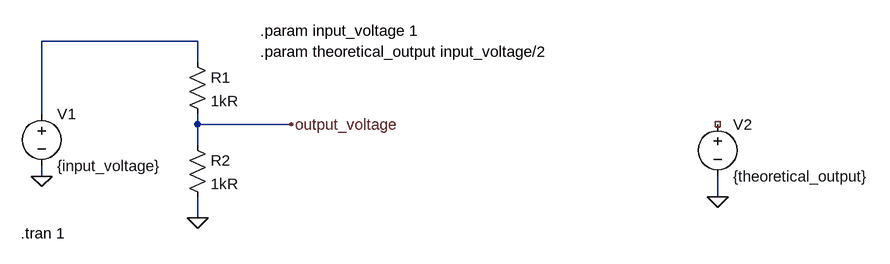
[diagram p0: schematic Draft9 param and step directives.asc]
Draft9 param and step directives.asc, the LTspice schematic file:
Version 4.1
SHEET 1 1248 680
WIRE 176 48 -64 48
WIRE 176 80 176 48
WIRE -64 160 -64 48
WIRE 176 176 176 160
WIRE 320 176 176 176
WIRE 176 208 176 176
WIRE -64 256 -64 240
WIRE 976 288 976 256
WIRE 176 320 176 288
FLAG -64 256 0
FLAG 176 320 0
FLAG 320 176 output_voltage
FLAG 976 288 0
SYMBOL voltage -64 144 R0
WINDOW 123 0 0 Left 0
WINDOW 39 0 0 Left 0
SYMATTR InstName V1
SYMATTR Value {input_voltage}
SYMBOL res 160 64 R0
SYMATTR InstName R1
SYMATTR Value 1kR
SYMBOL res 160 192 R0
SYMATTR InstName R2
SYMATTR Value 1kR
SYMBOL voltage 976 160 R0
WINDOW 123 0 0 Left 0
WINDOW 39 0 0 Left 0
SYMATTR InstName V2
SYMATTR Value {theoretical_output}
TEXT 272 32 Left 2 !.param input_voltage 1
TEXT 272 64 Left 2 !.param theoretical_output input_voltage/2
TEXT -96 344 Left 2 !.tran 1

The netlist it stands for:
* Draft9 param and step directives.asc
V1 N001 0 {input_voltage}
R1 N001 output_voltage 1kR
R2 output_voltage 0 1kR
V2 NC_01 0 {theoretical_output}
.param input_voltage 1
.param theoretical_output input_voltage/2
.tran 1
.backanno
.end